# Altium project 2024001 A Soutra Plainsong Metronome.PrjPcb (part 1 of 3)
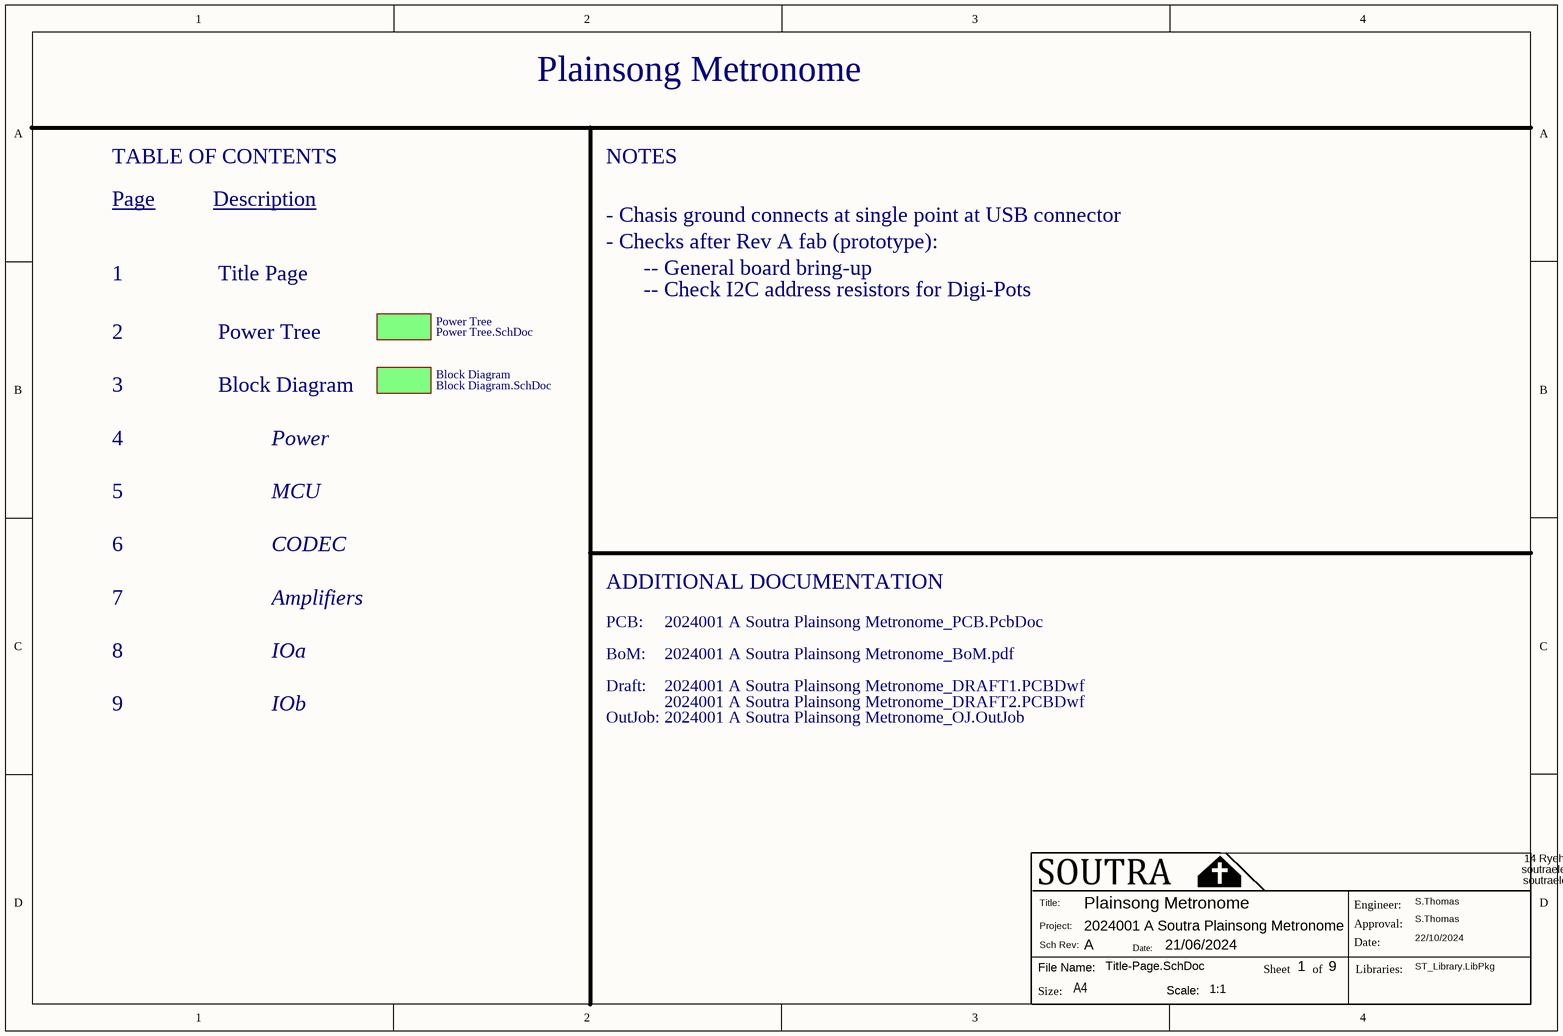
[diagram p0: Title-Page.SchDoc]
Website: soutraelectronics.com; TotalSheets: 9; Title: Plainsong Metronome; SCH_SCALE: 1:1; Sch_Rev: A; Rev_Date: 21/06/2024; Project: 2024001 A Soutra Plainsong Metronome; Pcb_Scale: 1/1; PCB_Rev: A; PCB_Doc: 2024001 A Soutra Plainsong Metronome_PCB.PcbDoc; OutJob_Doc: 2024001 A Soutra Plainsong Metronome_OJ.OutJob; Library: ST_Library.LibPkg; ERC: 2024001 A Soutra Plainsong Metronome_ERC; Engineer: S.Thomas; Draft_Rev: A; Draft_Doc: Draft_Doc.draft; Draft2_Doc: 2024001 A Soutra Plainsong Metronome_DRAFT2.PCBDwf; Draft1_Doc: 2024001 A Soutra Plainsong Metronome_DRAFT1.PCBDwf; Contact: soutraelectronics@gmail.com    +44(0)7874693650; BoM_Rev: A; BoM_Doc: 2024001 A Soutra Plainsong Metronome_BoM.pdf; Approver: S.Thomas; Approval_Date: 22/10/2024; Address: 14 Ryehill Gardens, Edinburgh, EH6 8ER
9 sheets, 157 parts. Net scope: flat (ports and power ports of the same name join across sheets).
Board file: 2024001 A Soutra Plainsong Metronome_PCB.PcbDoc
Sheets:
  Title-Page.SchDoc
    Power Tree = Power Tree.SchDoc
    Block Diagram = Block Diagram.SchDoc
      Designator = Power.SchDoc
      Designator = CODEC.SchDoc
      Designator = MCU.SchDoc
      Designator = Amplifiers.SchDoc
      Designator = IOa.SchDoc
      Designator = IOb.SchDoc

## Sheet Title-Page.SchDoc: Plainsong Metronome
size A4; SheetNumber: 1; SheetTotal: 9

### Sub-sheets
Block Diagram = Block Diagram.SchDoc: no entries
Power Tree = Power Tree.SchDoc: no entries

### Notes on the sheet
- TABLE OF CONTENTS
- NOTES
- Page
- Description
- - Chasis ground connects at single point at USB connector
- 1
- Title Page
- - Checks after Rev A fab (prototype):
- -- General board bring-up
- -- Check I2C address resistors for Digi-Pots
- 2
- Power Tree
- 3
- 4
- Block Diagram
- Power
- 5
- MCU
- 6
- CODEC
- 7
- Amplifiers
- ADDITIONAL DOCUMENTATION
- PCB:
- 8
- 9
- IOa
- IOb
- BoM:
- Draft:
- OutJob:
- Title:
- Engineer:
- File Name:
- Size:
- Project:
- Sch Rev:
- Date:
- Scale:
- Sheet
- of
- Approval:
- Libraries:
- A4

## Sheet Power Tree.SchDoc: Plainsong Metronome
size A4; SheetNumber: 2; SheetTotal: 9
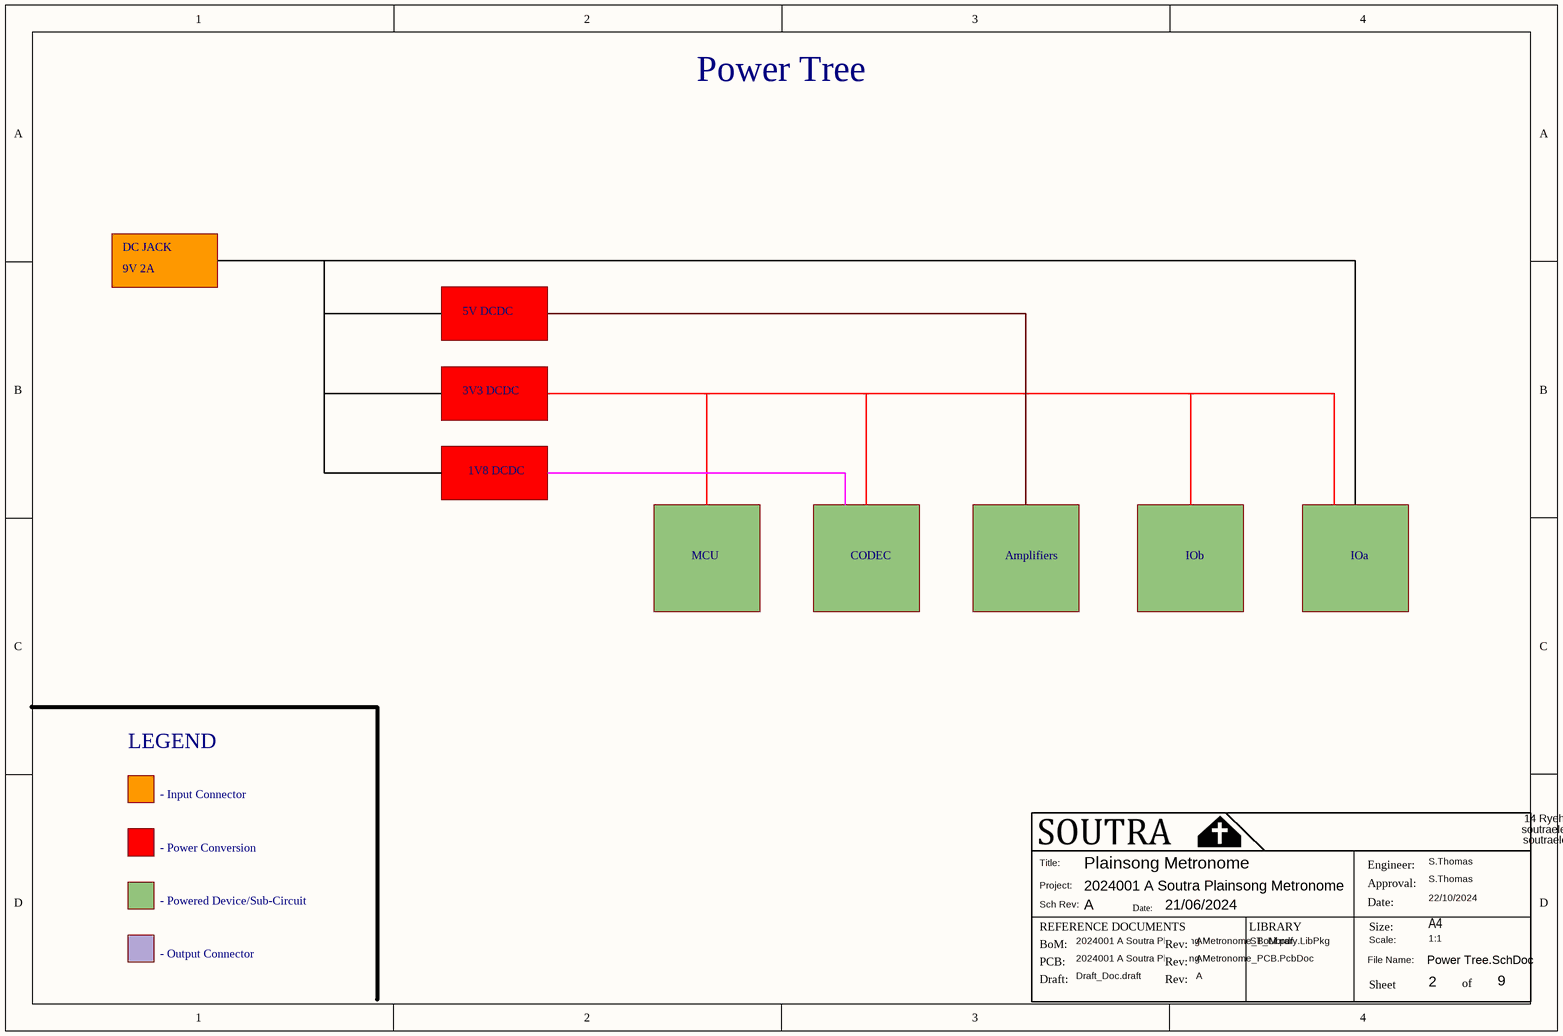
[diagram p1: Power Tree.SchDoc]

### Notes on the sheet
- Power Tree
- DC JACK
- 9V 2A
- 5V DCDC
- 3V3 DCDC
- 1V8 DCDC
- MCU
- CODEC
- Amplifiers
- IOb
- IOa
- LEGEND
- - Input Connector
- - Power Conversion
- - Powered Device/Sub-Circuit
- Title:
- Project:
- Sch Rev:
- Date:
- Engineer:
- Approval:
- - Output Connector
- REFERENCE DOCUMENTS
- BoM:
- PCB:
- Draft:
- Rev:
- LIBRARY
- File Name:
- Scale:
- Size:
- Sheet
- A4
- of

## Sheet Block Diagram.SchDoc: Plainsong Metronome
size A4; SheetNumber: 3; SheetTotal: 9
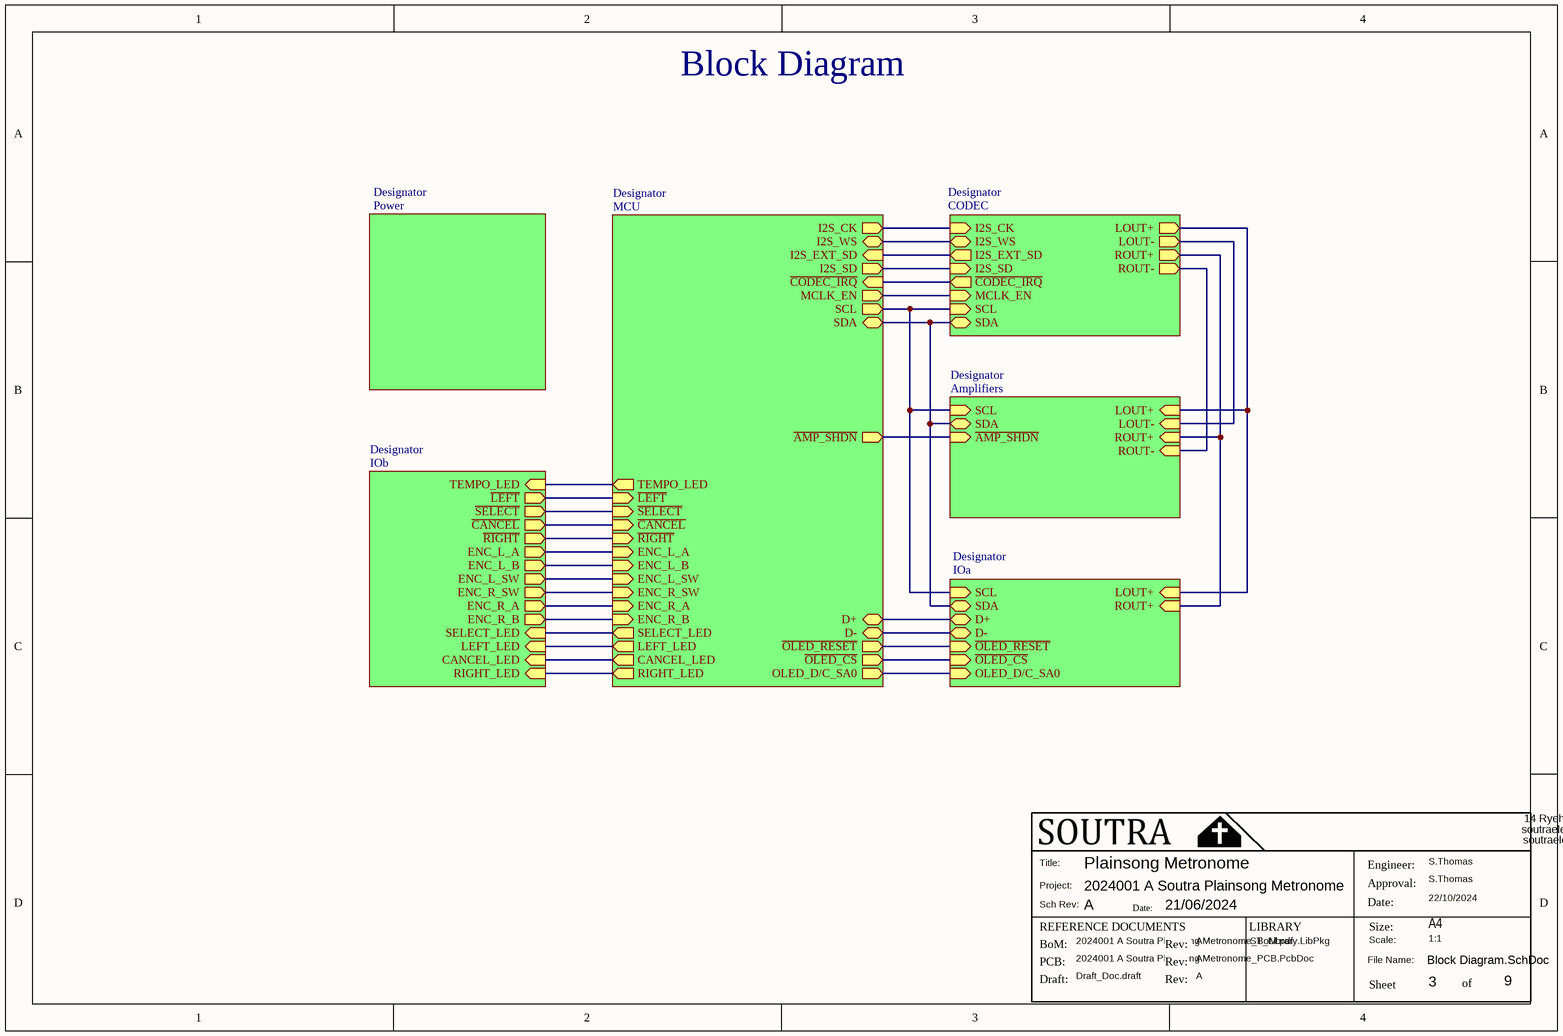
[diagram p2: Block Diagram.SchDoc]

### Sub-sheets
Designator = Power: no entries
Designator = CODEC: SCL (in), SDA (bidir), I2S_SD (in), I2S_EXT_SD (out), I2S_WS (bidir), I2S_CK (in), ~{CODEC_IRQ} (out), LOUT+ (out), LOUT- (out), ROUT+ (out), ROUT- (out), MCLK_EN (in)
Designator = MCU: D- (bidir), D+ (bidir), ENC_L_A (in), ENC_L_SW (in), ENC_L_B (in), RIGHT_LED (out), LEFT_LED (out), ~{LEFT} (in), ~{RIGHT} (in), ~{SELECT} (in), ENC_R_SW (in), ENC_R_A (in), ENC_R_B (in), SCL (out), SDA (bidir), ~{CANCEL} (in), TEMPO_LED (out), SELECT_LED (out), CANCEL_LED (out), I2S_SD (out), I2S_EXT_SD (in), I2S_WS (bidir), I2S_CK (out), ~{CODEC_IRQ} (in), MCLK_EN (out), ~{OLED_CS} (out), ~{OLED_RESET} (out), OLED_D/C_SA0 (out), ~{AMP_SHDN} (out)
Designator = Amplifiers: ROUT+ (in), ROUT- (in), ~{AMP_SHDN} (in), LOUT+ (in), SCL (in), SDA (bidir), LOUT- (in)
Designator = IOa: D- (bidir), D+ (bidir), LOUT+ (in), ROUT+ (in), ~{OLED_CS} (in), ~{OLED_RESET} (in), OLED_D/C_SA0 (in), SDA (bidir), SCL (in)
Designator = IOb: ~{LEFT} (out), ~{SELECT} (out), ~{CANCEL} (out), ~{RIGHT} (out), ENC_L_A (out), ENC_L_B (out), ENC_L_SW (out), ENC_R_SW (out), ENC_R_A (out), ENC_R_B (out), SELECT_LED (in), LEFT_LED (in), CANCEL_LED (in), RIGHT_LED (in), TEMPO_LED (in)

### Nets
(unnamed): sheet Designator/SCL, sheet Designator/SCL, sheet Designator/SCL, sheet Designator/SCL
(unnamed): sheet Designator/SDA, sheet Designator/SDA, sheet Designator/SDA, sheet Designator/SDA
(unnamed): sheet Designator/I2S_SD, sheet Designator/I2S_SD
(unnamed): sheet Designator/I2S_EXT_SD, sheet Designator/I2S_EXT_SD
(unnamed): sheet Designator/I2S_WS, sheet Designator/I2S_WS
(unnamed): sheet Designator/I2S_CK, sheet Designator/I2S_CK
(unnamed): sheet Designator/~{CODEC_IRQ}, sheet Designator/~{CODEC_IRQ}
(unnamed): sheet Designator/LOUT+, sheet Designator/LOUT+, sheet Designator/LOUT+
(unnamed): sheet Designator/LOUT-, sheet Designator/LOUT-
(unnamed): sheet Designator/ROUT+, sheet Designator/ROUT+, sheet Designator/ROUT+
(unnamed): sheet Designator/ROUT-, sheet Designator/ROUT-
(unnamed): sheet Designator/MCLK_EN, sheet Designator/MCLK_EN
(unnamed): sheet Designator/D-, sheet Designator/D-
(unnamed): sheet Designator/D+, sheet Designator/D+
(unnamed): sheet Designator/ENC_L_A, sheet Designator/ENC_L_A
(unnamed): sheet Designator/ENC_L_SW, sheet Designator/ENC_L_SW
(unnamed): sheet Designator/ENC_L_B, sheet Designator/ENC_L_B
(unnamed): sheet Designator/RIGHT_LED, sheet Designator/RIGHT_LED
(unnamed): sheet Designator/LEFT_LED, sheet Designator/LEFT_LED
(unnamed): sheet Designator/~{LEFT}, sheet Designator/~{LEFT}
(unnamed): sheet Designator/~{RIGHT}, sheet Designator/~{RIGHT}
(unnamed): sheet Designator/~{SELECT}, sheet Designator/~{SELECT}
(unnamed): sheet Designator/ENC_R_SW, sheet Designator/ENC_R_SW
(unnamed): sheet Designator/ENC_R_A, sheet Designator/ENC_R_A
(unnamed): sheet Designator/ENC_R_B, sheet Designator/ENC_R_B
(unnamed): sheet Designator/~{CANCEL}, sheet Designator/~{CANCEL}
(unnamed): sheet Designator/TEMPO_LED, sheet Designator/TEMPO_LED
(unnamed): sheet Designator/SELECT_LED, sheet Designator/SELECT_LED
(unnamed): sheet Designator/CANCEL_LED, sheet Designator/CANCEL_LED
(unnamed): sheet Designator/~{OLED_CS}, sheet Designator/~{OLED_CS}
(unnamed): sheet Designator/~{OLED_RESET}, sheet Designator/~{OLED_RESET}
(unnamed): sheet Designator/OLED_D/C_SA0, sheet Designator/OLED_D/C_SA0
(unnamed): sheet Designator/~{AMP_SHDN}, sheet Designator/~{AMP_SHDN}

### Notes on the sheet
- Block Diagram
- Title:
- Project:
- Sch Rev:
- Date:
- Engineer:
- Approval:
- REFERENCE DOCUMENTS
- BoM:
- PCB:
- Draft:
- Rev:
- LIBRARY
- File Name:
- Scale:
- Size:
- Sheet
- A4
- of

## Sheet Power.SchDoc: Plainsong Metronome
size A4; SheetNumber: 4; SheetTotal: 9
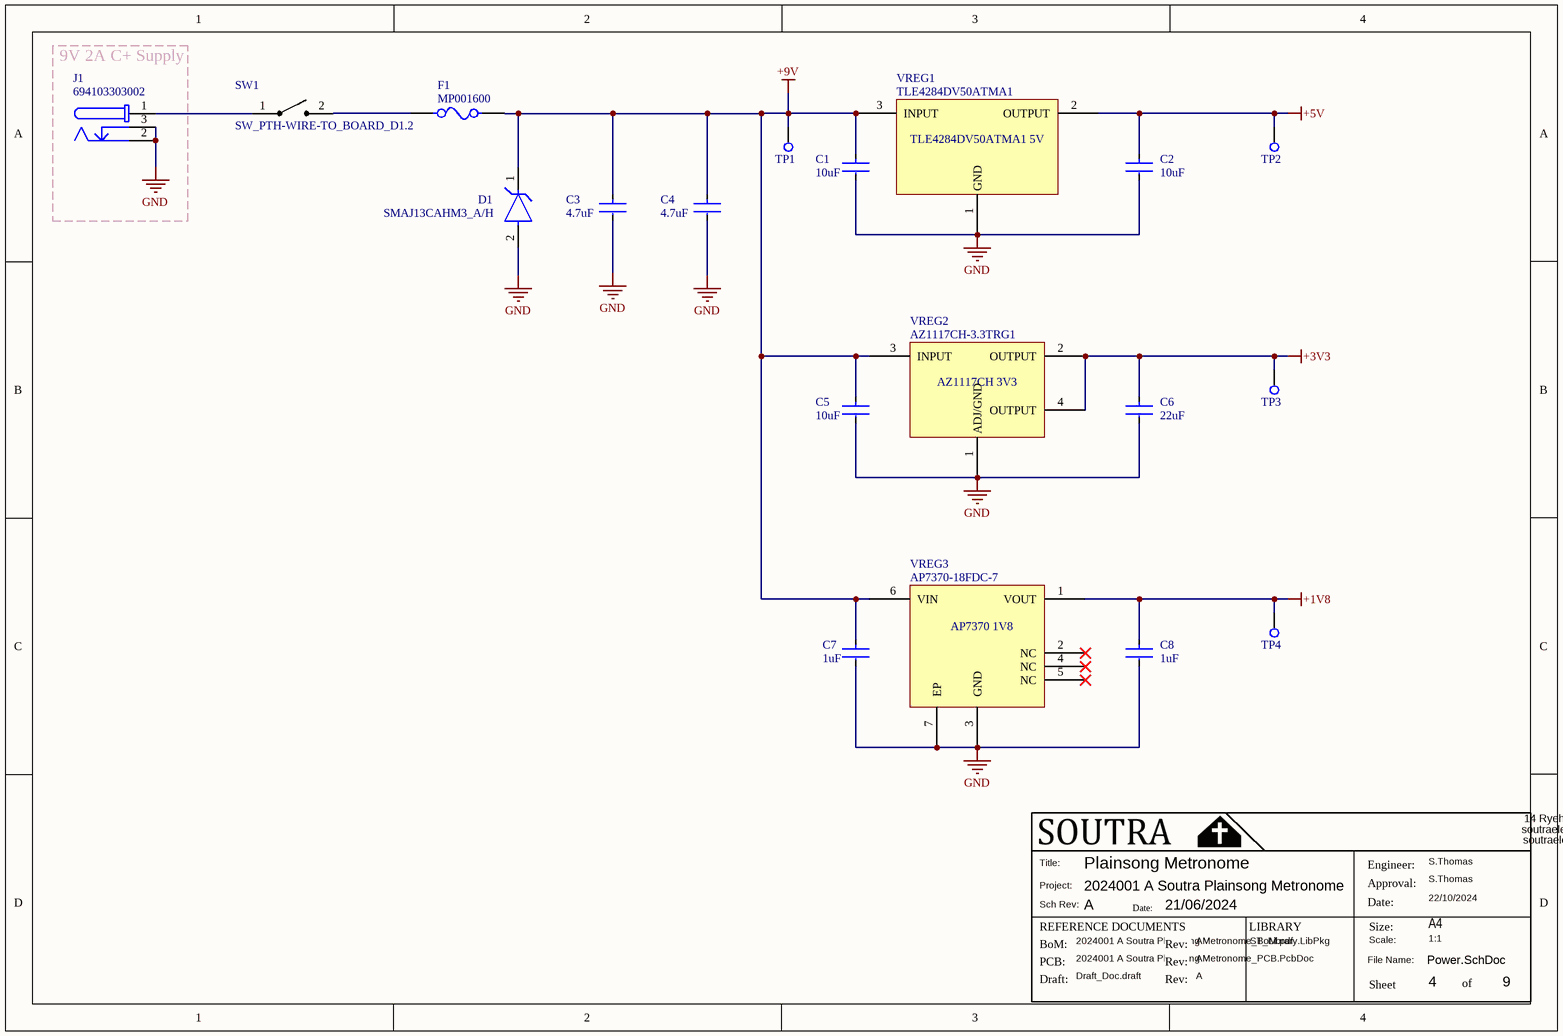
[diagram p3: Power.SchDoc]

### Parts
C1  value 10uF  [CC1206-IPC_A]  (hidden comment: 1206B106K250CP)
C2  value 10uF  [CC1206-IPC_A]  (hidden comment: 1206B106K250CP)
C3  value 4.7uF  [CC1206-IPC_A]  (hidden comment: CL31B475KAHNNNE)
C4  value 4.7uF  [CC1206-IPC_A]  (hidden comment: CL31B475KAHNNNE)
C5  value 10uF  [CC1206-IPC_A]  (hidden comment: 1206B106K250CP)
C6  value 22uF  [CAPC2012X14L]  (hidden comment: GRM21BR61A226ME51L)
C7  value 1uF  [CAPC1005X06L]  (hidden comment: CC0402KRX5R6BB105)
C8  value 1uF  [CAPC1005X06L]  (hidden comment: CC0402KRX5R6BB105)
D1  SMAJ13CAHM3_A/H  [SODFL511X229-2N]
F1  MP001600  [FUSE_3216X08L]
J1  694103303002  [WURTH_694106301002]
SW1  SW_PTH-WIRE-TO_BOARD_D1.2  [SW_PTH-Wire-to-Board-D1.2]
TP1  TP_CIRCLE_R1  [TP_CIRCLE_R1]  (value not drawn)
TP2  TP_CIRCLE_R1  [TP_CIRCLE_R1]  (value not drawn)
TP3  TP_CIRCLE_R1  [TP_CIRCLE_R1]  (value not drawn)
TP4  TP_CIRCLE_R1  [TP_CIRCLE_R1]  (value not drawn)
VREG1  TLE4284DV50ATMA1  [TO252-3-11_L]
VREG2  AZ1117CH-3.3TRG1  [SOT230P700X180-4L]
VREG3  AP7370-18FDC-7  [U-DFN2020EP65P201X201X63_HS-7L]

### Blocks framed on the sheet
9V 2A C+ Supply: J1

### Nets
+1V8: C8.1 TP4.1 VREG3.1(VOUT)
+3V3: C6.1 TP3.1 VREG2.2(OUTPUT) VREG2.4(OUTPUT)
+5V: C2.1 TP2.1 VREG1.2(OUTPUT)
+9V: C1.1 C3.1 C4.1 C5.1 C7.1 D1.1(C) F1.2 TP1.1 VREG1.3(INPUT) VREG2.3(INPUT) VREG3.6(VIN)
GND: C1.2 C2.2 C3.2 C4.2 C5.2 C6.2 C7.2 C8.2 D1.2(A) J1.2 J1.3 VREG1.1(GND) VREG2.1(ADJ/GND) VREG3.3(GND) VREG3.7(EP)
NetF1_1: F1.1 SW1.2
NetJ1_1: J1.1 SW1.1

Not connected (* = marked no-connect by the designer): VREG3 2(NC)* 4(NC)* 5(NC)*

### Notes on the sheet
- Title:
- Project:
- Sch Rev:
- Date:
- Engineer:
- Approval:
- REFERENCE DOCUMENTS
- BoM:
- PCB:
- Draft:
- Rev:
- LIBRARY
- File Name:
- Scale:
- Size:
- Sheet
- A4
- of
- (in symbol AP7370-18FDC-7) AP7370 1V8
- (in symbol AZ1117CH-3.3TRG1) AZ1117CH 3V3
- (in symbol TLE4284DV50ATMA1) TLE4284DV50ATMA1 5V

### Library data of the parts
C1 C2 C5 = 1206B106K250CP: Cap, 10Uf, 25V, Mlcc, 1206 Rohs Compliant: Yes; Manufacturer: Walsin Technologies; Supplier 1: Farnell; Supplier Part Number 1: 3764170; Manufacturer Part Number: 1206B106K250CP; RoHS: No; Stock 1: 1410; Pricing 1: 5=0.114, 50=0.11, 250=0.098, 500=0.096, 1000=0.094 (GBP)
C3 C4 = CL31B475KAHNNNE: Ceramic Capacitor, Multilayer, Ceramic, 25V, 10% +Tol, 10% -Tol, X7R, 15% TC, 4.7uF, Surface Mount, 1206; Manufacturer: Samsung; Multilayer: Yes; Supplier: Digikey; Supplier Part Number: 1276-1055-1-ND; Manufacturer Part Number: CL31B475KAHNNNE; RoHS: Yes; Category: Ceramic Capacitors; Stock: 245034; Pricing: 1=0.18, 10=0.116, 50=0.0732, 100=0.0585, 500=0.04228, 1000=0.0374 (USD); Mounting Technology: Surface Mount; Pins: 2; Dielectric Material: Ceramic; Package Shape: Rectangular; Case/Package: 1206; Terminal Finish: Nickel; Min Operating Temperature: -55°C; Max Operating Temperature: 125°C; JESD-609 Code: e3; Capacitor Type: Ceramic; Tolerance  (fill in as +-): 10%; Package Style: SMTMeter; Packaging: Tape and Reel; Tolerance (fill in as +-): 10%; Rated DC Voltage (URdc): 25V; Temperature Characteristics Code: X7R; Termination: Wraparound; Length: 3.2mm; Width: 1.6mm; Height: 1.8mm; Reach SVHC Compliant: Yes; RoHS Compliant: Yes; ComponentLink1URL: https://datasheet.ciiva.com:443/pdfs/VipMasterIC/IC/SEMS/SEMS-S-A0008522756/SEMS-S-A0008522493-1.pdf?src-supplier=IHS+Markit; ComponentLink1Description: https://datasheet.ciiva.com:443/pdfs/VipMasterIC/IC/SEMS/SEMS-S-A0008522756/SEMS-S-A0008522493-1.pdf?src-supplier=IHS+Markit; ComponentLink2URL: https://datasheet.ciiva.com/25728/cl31b475kahnnne-25728538.pdf?src-supplier=Digikey; ComponentLink2Description: https://datasheet.ciiva.com/25728/cl31b475kahnnne-25728538.pdf?src-supplier=Digikey; ComponentLink3URL: https://datasheet.ciiva.com/29200/452772-da-01-en-vs-kondensator-1206-29200897.pdf?src-supplier=Conrad; ComponentLink3Description: https://datasheet.ciiva.com/29200/452772-da-01-en-vs-kondensator-1206-29200897.pdf?src-supplier=Conrad; ComponentLink4URL: https://datasheet.ciiva.com/29200/452785-da-01-en-vs-kondensator-1206-29200901.pdf?src-supplier=Conrad; ComponentLink4Description: https://datasheet.ciiva.com/29200/452785-da-01-en-vs-kondensator-1206-29200901.pdf?src-supplier=Conrad; ComponentLink5URL: https://datasheet.ciiva.com/26310/mlcc-catalogdownload2013-eng-26310092.pdf?src-supplier=Distrelec; ComponentLink5Description: https://datasheet.ciiva.com/26310/mlcc-catalogdownload2013-eng-26310092.pdf?src-supplier=Distrelec; ComponentLink6URL: https://datasheet.ciiva.com/16428/cl10c1r5bb8nnnc-16428942.pdf?src-supplier=Future+Electronics; ComponentLink6Description: https://datasheet.ciiva.com/16428/cl10c1r5bb8nnnc-16428942.pdf?src-supplier=Future+Electronics; Supplier 1: Farnell; Supplier Part Number 1: 3013532; Pricing 1: 5=0.08, 50=0.05
C6 = GRM21BR61A226ME51L: SMD Multilayer Ceramic Capacitor, 22 µF, 10 V, 0805 [2012 Metric], ± 20%, X5R, GRM Series; Alternative Part: C2012X5R1A226M125AB; Alternative Part Manufacturer: TDK; Manufacturer: Murata; Supplier 1: Farnell; Supplier Part Number 1: 2494270; Pricing 1: 5=0.192, 50=0.09; Stock 1: 79616; Alternative Supplier: Digikey; Alternative Supplier Part Number: 490-10511-1-ND; Pricing 2: 1=0.22, 10=0.14, 50=0.09, 100=0.07; Alternative Part Supplier: Farnell; Alternative Part Supplier Part Number: 2525131; Manufacturer Part Number: GRM21BR61A226ME51L
C7 C8 = CC0402KRX5R6BB105: Ceramic Capacitor, Multilayer, Ceramic, 10V, 10% +Tol, 10% -Tol, X5R, 15% TC, 1uF, Surface Mount, 0402; Manufacturer: Yageo; Alternative Part: 0402ZD105KAT2A; Alternative Part Manufacturer: KYOCERA AVX; Multilayer: Yes; Supplier: Farnell; Supplier Part Number: 1458896; Manufacturer Part Number: CC0402KRX5R6BB105; RoHS: Yes; Category: Ceramic Capacitors; Stock: 12220000; Pricing: 10=0.039, 100=0.023; Mounting Technology: Surface Mount; Pins: 2; Dielectric Material: Ceramic; Package Shape: Rectangular; Case/Package: 0402; Terminal Finish: Nickel; Min Operating Temperature: -55°C; Max Operating Temperature: 85°C; JESD-609 Code: e3; Capacitor Type: Ceramic; Tolerance  (fill in as +-): 10%; Package Style: SMTMeter; Packaging: Tape and Reel; Tolerance (fill in as +-): 10%; Rated DC Voltage (URdc): 10V; Temperature Characteristics Code: X5R; Termination: Wraparound; Length: 1mm; Width: 0.5mm; Height: 0.5mm; Reach SVHC Compliant: Yes; RoHS Compliant: Yes; ComponentLink1URL: https://datasheet.ciiva.com:443/pdfs/VipMasterIC/IC/YAGO/YAGO-S-A0006851646/YAGO-S-A0006851646-1.pdf?src-supplier=IHS+Markit; ComponentLink1Description: https://datasheet.ciiva.com:443/pdfs/VipMasterIC/IC/YAGO/YAGO-S-A0006851646/YAGO-S-A0006851646-1.pdf?src-supplier=IHS+Markit; ComponentLink2URL: https://datasheet.ciiva.com/176/upy-gphc-x5r-4v-to-50v-12-176704.pdf?src-supplier=Digi-Key; ComponentLink2Description: https://datasheet.ciiva.com/176/upy-gphc-x5r-4v-to-50v-12-176704.pdf?src-supplier=Digi-Key; ComponentLink3URL: https://datasheet.ciiva.com/176/mlccorderingcode-176705.pdf?src-supplier=Digi-Key; ComponentLink3Description: https://datasheet.ciiva.com/176/mlccorderingcode-176705.pdf?src-supplier=Digi-Key; ComponentLink4URL: https://datasheet.ciiva.com/176/mlccorderingcode-176706.pdf?src-supplier=Digi-Key; ComponentLink4Description: https://datasheet.ciiva.com/176/mlccorderingcode-176706.pdf?src-supplier=Digi-Key; Supplier 1: Digikey; Supplier Part Number 1: 311-1439-1-ND; Pricing 1: 1=0.08, 10=0.058, 50=0.034, 100=0.027; Alternative Part Supplier: Farnell; Alternative Part Supplier Part Number: 1740588
D1 = SMAJ13CAHM3_A/H: TVS Diode, TRANSZORB SMAJ, Bidirectional, 13 V, 21.5 V, DO-214AC (SMA), 2 Pins; Manufacturer: Vishay; Supplier 1: Farnell; Supplier Part Number 1: 3530003; Pricing 1: 5=0.168, 10=0.146, 100+0.122; Stock 1: 8321; Manufacturer Part Number: SMAJ13CAHM3_A/H
F1 = MP001600: MULTICOMP PRO MP001600Fuse, Surface Mount, 1.5 A, Fast Acting, 72 VDC, 1206 [3216 Metric]; Supplier: Farnell; Supplier Part Number: 3285103; Manufacturer: Multicomp; Manufacturer Part Number: MP001600; RoHS: No; Stock: 2998; Pricing: 5=0.094, 50=0.0739, 250=0.0627, 500=0.0559, 1500=0.0459 (GBP)
J1 = 694103303002: Circular DC Power Connector; Manufacturer: Wurth Electronics; Connector Type: Circular,Power; Supplier: Farnell; Supplier Part Number: 2472149; Manufacturer Part Number: 694103303002; RoHS: Yes; Category: Connectors; Stock: 6324; Pricing: 1=1.14, 10=0.84, 100=0.78; Contact Finish - Mating: NOT SPECIFIED; Reach SVHC Compliant: Yes; RoHS Compliant: Yes; ComponentLink1URL: https://datasheet.ciiva.com:443/pdfs/VipMasterIC/IC/MIDC/MIDC-S-A0001193031/MIDC-S-A0001193031-1.pdf?src-supplier=IHS+Markit; ComponentLink1Description: https://datasheet.ciiva.com:443/pdfs/VipMasterIC/IC/MIDC/MIDC-S-A0001193031/MIDC-S-A0001193031-1.pdf?src-supplier=IHS+Markit; ComponentLink2URL: http://www.mouser.com/ds/2/445/6941xx303002-469289.pdf?src-supplier=Mouser; ComponentLink2Description: http://www.mouser.com/ds/2/445/6941xx303002-469289.pdf?src-supplier=Mouser; ComponentLink3URL: http://www.farnell.com/cad/2130963.pdf?src-supplier=Element14; ComponentLink3Description: http://www.farnell.com/cad/2130963.pdf?src-supplier=Element14; ComponentLink4URL: https://katalog.we-online.de/em/datasheet/6941xx303002.pdf?src-supplier=Digikey; ComponentLink4Description: https://katalog.we-online.de/em/datasheet/6941xx303002.pdf?src-supplier=Digikey; Supplier 1: Digikey; Supplier Part Number 1: 732-5930-ND; Stock 1: 11140; Pricing 1: 1=0.81, 10=0.77, 50=0.68, 100=0.63
SW1 = SW_PTH-WIRE-TO_BOARD_D1.2: PTH Mounting Holes for Wire-to-board switch, 1.2mm diameter, >=17AWG
TP1-TP4 = TP_CIRCLE_R1: Test Point, SMD, Circular, Radius = 1mm
VREG1 = TLE4284DV50ATMA1: Manufacturer: Infineon; Supplier 1: Farnell; Supplier Part Number 1: TLE4284DV50ATMA1; Pricing 1: 5=1.49, 50=1.38, 100=1.27; Stock 1: 24605; Manufacturer Part Number: TLE4284DV50ATMA1
VREG2 = AZ1117CH-3.3TRG1: Fixed Positive LDO Regulator, 3.3V, 1.3V Dropout, BIPolar, PDSO3; Manufacturer: Diodes; Package Body Material: Plastic; Dropout Voltage1-Nom: 1.2V; Input Voltage Absolute-Max: 18V; Max Supply Voltage: 15V; Line Regulation-Max: 0.01%; Load Regulation-Max: 0.015%; Channels: 1; Output Current1-Max: 800mA; Output Voltage1-Max: 3.365V; Output Voltage1-Min: 3.235V; Regulator Type: FIXED POSITIVE SINGLE OUTPUT LDO REGULATOR; Voltage Tolerance-Max: 1.97%; Qualification Status: Not Qualified; Supplier: Farnell; Supplier Part Number: 3483073; Manufacturer Part Number: AZ1117CH-3.3TRG1; RoHS: Yes; Category: Voltage Regulators - Linear; Stock: 8830; Pricing: 5=0.42, 10=0.25, 100=0.12; Case/Package: SOP; Pins: 3; Package Shape: Rectangular; Terminal Finish: Tin; JESD-609 Code: e3; Adjustability: FIXED; Dropout Voltage1-Max: 1.3V; JESD-30 Code: R-PDSO-G3; Moisture Sensitivity Level: 1; Number of Outputs: 1; Operating Temperature, TJ-Max: 125°C; Operating Temperature, TJ-Min: -20°C; Output Voltage1-Nom: 3.3V; Package Style: SMALL OUTLINEMeter; Packaging: Tape and Reel; Surface Mount: Yes; Technology: BIPOLAR; Terminal Form: Gull Wing; Terminal Position: DUAL; Length: 6.5mm; Width: 3.5mm; Terminal Pitch: 2.3mm; Height - Seated (Max): 1.8mm; Reach SVHC Compliant: Yes; RoHS Compliant: Yes; ComponentLink1URL: https://datasheet.ciiva.com:443/pdfs/VipMasterIC/IC/DIOD/DIOD-S-A0007713706/DIOD-S-A0007713706-1.pdf?src-supplier=IHS+Markit; ComponentLink1Description: https://datasheet.ciiva.com:443/pdfs/VipMasterIC/IC/DIOD/DIOD-S-A0007713706/DIOD-S-A0007713706-1.pdf?src-supplier=IHS+Markit; ComponentLink2URL: https://datasheet.ciiva.com/29569/az1117c-29569913.pdf?src-supplier=Digikey; ComponentLink2Description: https://datasheet.ciiva.com/29569/az1117c-29569913.pdf?src-supplier=Digikey; ComponentLink3URL: https://datasheet.ciiva.com/29569/az1117c-29569914.pdf?src-supplier=Digikey; ComponentLink3Description: https://datasheet.ciiva.com/29569/az1117c-29569914.pdf?src-supplier=Digikey; ComponentLink4URL: https://datasheet.ciiva.com/29569/az1117c-29569915.pdf?src-supplier=Digikey; ComponentLink4Description: https://datasheet.ciiva.com/29569/az1117c-29569915.pdf?src-supplier=Digikey; Supplier 1: Digikey; Supplier Part Number 1: AZ1117CH-3.3TRG1DICT-ND; Pricing 1: 1=0.36, 10=0.27, 25=0.23, 100=0.15
VREG3 = AP7370-18FDC-7: Fixed Positive LDO Regulator; Manufacturer: Diodes; Supplier: Farnell; Supplier Part Number: 3864505; Manufacturer Part Number: AP7370-18FDC-7; RoHS: Yes; Stock: 2900; Pricing: 5=0.53, 10=0.42, 100=0.23; Supplier 1: Mouser; Supplier Part Number 1: 621-AP7370-18FDC-7; Pricing 1: 1=0.38, 10=0.271, 100=0.19

## Sheet CODEC.SchDoc: Plainsong Metronome
size A4; SheetNumber: 6; SheetTotal: 9
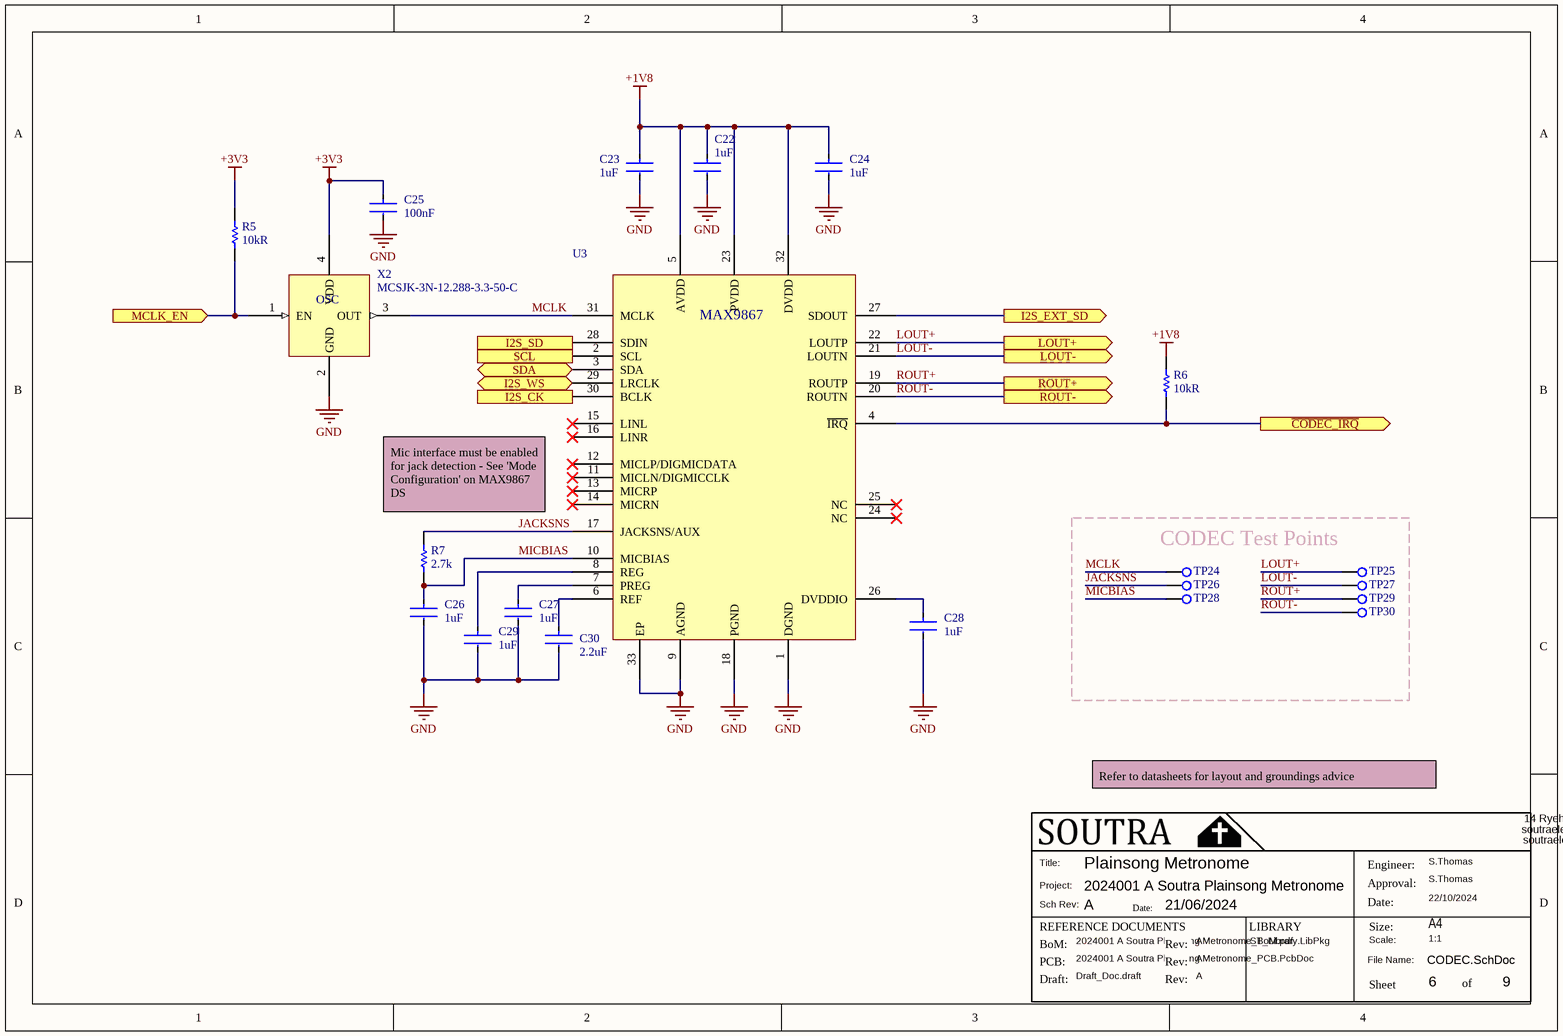
[diagram p4: CODEC.SchDoc]

### Parts
C22  value 1uF  [CAPC1005X06L]  (hidden comment: CC0402KRX5R6BB105)
C23  value 1uF  [CAPC1005X06L]  (hidden comment: CC0402KRX5R6BB105)
C24  value 1uF  [CAPC1005X06L]  (hidden comment: CC0402KRX5R6BB105)
C25  value 100nF  [CAPC1005X06L]  (hidden comment: 0402X104M160CT)
C26  value 1uF  [CAPC1005X06L]  (hidden comment: CC0402KRX5R6BB105)
C27  value 1uF  [CAPC1005X06L]  (hidden comment: CC0402KRX5R6BB105)
C28  value 1uF  [CAPC1005X06L]  (hidden comment: CC0402KRX5R6BB105)
C29  value 1uF  [CAPC1005X06L]  (hidden comment: CC0402KRX5R6BB105)
C30  value 2.2uF  [CAPC1005X06L]  (hidden comment: CC0402MRX5R5BB225)
R5  value 10kR  [RESC_0805_2013X50X30LL20T20]  (hidden comment: RC0805JR-0710KL)
R6  value 10kR  [RESC_0805_2013X50X30LL20T20]  (hidden comment: RC0805JR-0710KL)
R7  value 2.7k  [RESC_0805_2013X50X30LL20T20]  (hidden comment: CRGH0805F2K7)
TP24  TP_CIRCLE_R1  [TP_CIRCLE_R1]  (value not drawn)
TP25  TP_CIRCLE_R1  [TP_CIRCLE_R1]  (value not drawn)
TP26  TP_CIRCLE_R1  [TP_CIRCLE_R1]  (value not drawn)
TP27  TP_CIRCLE_R1  [TP_CIRCLE_R1]  (value not drawn)
TP28  TP_CIRCLE_R1  [TP_CIRCLE_R1]  (value not drawn)
TP29  TP_CIRCLE_R1  [TP_CIRCLE_R1]  (value not drawn)
TP30  TP_CIRCLE_R1  [TP_CIRCLE_R1]  (value not drawn)
U3  (no value)  [TQFN50P500X500X80_HS-33L]
X2  MCSJK-3N-12.288-3.3-50-C  [X_MULTICOMP_MCSJK-3N-12.288-3.3-50-C]

### Blocks framed on the sheet
CODEC Test Points: TP24-TP30

### Ports
I2S_CK (in, see Block Diagram[3A], MCU[3B]), I2S_EXT_SD (out, see Block Diagram[3A], MCU[3B]), I2S_SD (in, see Block Diagram[3B], MCU[3B]), I2S_WS (bidir, see Block Diagram[3A], MCU[3B]), LOUT+ (out, see Block Diagram[4A], Amplifiers[1B], IOa[3A]), LOUT- (out, see Block Diagram[4A], Amplifiers[1B]), MCLK_EN (in, see Block Diagram[3B], MCU[3B]), ROUT+ (out, see Block Diagram[4A], Amplifiers[3B], IOa[3A]), ROUT- (out, see Block Diagram[4B], Amplifiers[3B]), SCL (in, see Block Diagram[3B], Amplifiers[1A], IOa[1C], MCU[4B]), SDA (bidir, see Block Diagram[3B], Amplifiers[1A], IOa[1C], MCU[4B]), ~{CODEC_IRQ} (out, see Block Diagram[3B], MCU[3B])

### Nets
+1V8: C22.1 C23.1 C24.1 R6.2 U3.5(AVDD) U3.23(PVDD) U3.32(DVDD)
+3V3: C25.1 R5.2 X2.4(VDD)
GND: C22.2 C23.2 C24.2 C25.2 C26.2 C27.2 C28.2 C29.2 C30.2 U3.1(DGND) U3.9(AGND) U3.18(PGND) U3.33(EP) X2.2(GND)
~{CODEC_IRQ}: R6.1 U3.4(~{IRQ}) ; port ~{CODEC_IRQ}
I2S_CK: U3.30(BCLK) ; port I2S_CK
I2S_EXT_SD: U3.27(SDOUT) ; port I2S_EXT_SD
I2S_SD: U3.28(SDIN) ; port I2S_SD
I2S_WS: U3.29(LRCLK) ; port I2S_WS
JACKSNS: R7.1 TP26.1 U3.17(JACKSNS/AUX)
LOUT+: TP25.1 U3.22(LOUTP) ; port LOUT+
LOUT-: TP27.1 U3.21(LOUTN) ; port LOUT-
MCLK: TP24.1 U3.31(MCLK) X2.3(OUT)
MCLK_EN: R5.1 X2.1(EN) ; port MCLK_EN
MICBIAS: C26.1 R7.2 TP28.1 U3.10(MICBIAS)
ROUT+: TP29.1 U3.19(ROUTP) ; port ROUT+
ROUT-: TP30.1 U3.20(ROUTN) ; port ROUT-
SCL: U3.2(SCL) ; port SCL
SDA: U3.3(SDA) ; port SDA
NetC27_1: C27.1 U3.7(PREG)
NetC28_1: C28.1 U3.26(DVDDIO)
NetC29_1: C29.1 U3.8(REG)
NetC30_1: C30.1 U3.6(REF)

Not connected (* = marked no-connect by the designer): U3 11(MICLN/DIGMICCLK)* 12(MICLP/DIGMICDATA)* 13(MICRP)* 14(MICRN)* 15(LINL)* 16(LINR)* 24(NC)* 25(NC)*

### Notes on the sheet
- (near R7) Mic interface must be enabled for jack detection - See 'Mode Configuration' on MAX9867 DS
- Refer to datasheets for layout and groundings advice
- Title:
- Project:
- Sch Rev:
- Date:
- Engineer:
- Approval:
- REFERENCE DOCUMENTS
- BoM:
- PCB:
- Draft:
- Rev:
- LIBRARY
- File Name:
- Scale:
- Size:
- Sheet
- A4
- of
- (in symbol MAX9867ETJ+T) MAX9867
- (in symbol MCSJK-3N-12.288-3.3-50-C) OSC

### Library data of the parts
C22-C24 C26-C29 = CC0402KRX5R6BB105: as C7 on sheet Power; Supplier: Farnell; Supplier Part Number: 1458896; Manufacturer Part Number: CC0402KRX5R6BB105; RoHS: Yes; Category: Ceramic Capacitors; Stock: 12220000; Pricing: 10=0.039, 100=0.023; Mounting Technology: Surface Mount; Pins: 2; Dielectric Material: Ceramic; Package Shape: Rectangular; Case/Package: 0402; Terminal Finish: Nickel; Min Operating Temperature: -55°C; Max Operating Temperature: 85°C; JESD-609 Code: e3; Capacitor Type: Ceramic; Tolerance  (fill in as +-): 10%; Package Style: SMTMeter; Packaging: Tape and Reel; Tolerance (fill in as +-): 10%; Rated DC Voltage (URdc): 10V; Temperature Characteristics Code: X5R; Termination: Wraparound; Length: 1mm; Width: 0.5mm; Height: 0.5mm; Reach SVHC Compliant: Yes; RoHS Compliant: Yes; ComponentLink1URL: https://datasheet.ciiva.com:443/pdfs/VipMasterIC/IC/YAGO/YAGO-S-A0006851646/YAGO-S-A0006851646-1.pdf?src-supplier=IHS+Markit; ComponentLink1Description: https://datasheet.ciiva.com:443/pdfs/VipMasterIC/IC/YAGO/YAGO-S-A0006851646/YAGO-S-A0006851646-1.pdf?src-supplier=IHS+Markit; ComponentLink2URL: https://datasheet.ciiva.com/176/upy-gphc-x5r-4v-to-50v-12-176704.pdf?src-supplier=Digi-Key; ComponentLink2Description: https://datasheet.ciiva.com/176/upy-gphc-x5r-4v-to-50v-12-176704.pdf?src-supplier=Digi-Key; ComponentLink3URL: https://datasheet.ciiva.com/176/mlccorderingcode-176705.pdf?src-supplier=Digi-Key; ComponentLink3Description: https://datasheet.ciiva.com/176/mlccorderingcode-176705.pdf?src-supplier=Digi-Key; ComponentLink4URL: https://datasheet.ciiva.com/176/mlccorderingcode-176706.pdf?src-supplier=Digi-Key; ComponentLink4Description: https://datasheet.ciiva.com/176/mlccorderingcode-176706.pdf?src-supplier=Digi-Key; Supplier 1: Digikey; Supplier Part Number 1: 311-1439-1-ND; Pricing 1: 1=0.08, 10=0.058, 50=0.034, 100=0.027; Alternative Part Supplier: Farnell; Alternative Part Supplier Part Number: 1740588
C25 = 0402X104M160CT: Ceramic Capacitor, Multilayer, Ceramic, 16V, 20% +Tol, 20% -Tol, X5R, 15% TC, 0.1uF, Surface Mount, 0402; Manufacturer: Walsin Technologies; Alternative Part: 885012105016; Alternative Part Manufacturer: WURTH; Multilayer: Yes; Supplier: Farnell; Supplier Part Number: 2524808; Manufacturer Part Number: 0402X104M160CT; RoHS: Yes; Category: Ceramic Capacitors; Stock: 1101; Pricing: 10=0.0047, 100=0.0043; Mounting Technology: Surface Mount; Pins: 2; Dielectric Material: Ceramic; Package Shape: Rectangular; Case/Package: 0402; Terminal Finish: Nickel; Min Operating Temperature: -55°C; Max Operating Temperature: 85°C; JESD-609 Code: e3; Capacitor Type: Ceramic; Tolerance  (fill in as +-): 20%; Package Style: SMTMeter; Packaging: Tape and Reel; Tolerance (fill in as +-): 20%; Rated DC Voltage (URdc): 16V; Temperature Characteristics Code: X5R; Termination: Wraparound; Length: 1mm; Width: 0.5mm; Height: 0.5mm; Reach SVHC Compliant: Yes; RoHS Compliant: Yes; ComponentLink1URL: https://datasheet.ciiva.com:443/pdfs/VipMasterIC/IC/WATC/WATC-S-A0009550342/WATC-S-A0009550342-1.pdf?src-supplier=IHS+Markit; ComponentLink1Description: https://datasheet.ciiva.com:443/pdfs/VipMasterIC/IC/WATC/WATC-S-A0009550342/WATC-S-A0009550342-1.pdf?src-supplier=IHS+Markit; ComponentLink2URL: http://www.farnell.com/datasheets/2009679.pdf?src-supplier=Farnell; ComponentLink2Description: http://www.farnell.com/datasheets/2009679.pdf?src-supplier=Farnell; ComponentLink3URL: http://www.farnell.com/datasheets/2340522.pdf?src-supplier=Farnell; ComponentLink3Description: http://www.farnell.com/datasheets/2340522.pdf?src-supplier=Farnell; ComponentLink4URL: https://datasheet.octopart.com/0402X104M160CT-Walsin-Technologies-datasheet-85392065.pdf?src-supplier=Element14; ComponentLink4Description: https://datasheet.octopart.com/0402X104M160CT-Walsin-Technologies-datasheet-85392065.pdf?src-supplier=Element14; ComponentLink5URL: https://datasheet.octopart.com/0402X104M160CT-Walsin-Technologies-datasheet-136037192.pdf?src-supplier=TECHDesign; ComponentLink5Description: https://datasheet.octopart.com/0402X104M160CT-Walsin-Technologies-datasheet-136037192.pdf?src-supplier=TECHDesign; Supplier Part Number 1: 1292-0402X104M160CT-ND; Supplier 1: Digikey; Pricing 1: 1=0.08, 10=0.023, 50=0.013, 100=0.01; Alternative Part Supplier: Farnell; Alternative Part Supplier Part Number: 2533933
C30 = CC0402MRX5R5BB225: Ceramic Capacitor, Multilayer, Ceramic, 6.3V, 20% +Tol, 20% -Tol, X5R, 15% TC, 2.2uF, Surface Mount, 0402; Manufacturer: Yageo; Alternative Part: MC0402X225M6R3CT; Multilayer: Yes; Suppler 2: Digikey; Supplier 1: Farnell; Supplier Part Number 1: 3369189; Manufacturer Part Number: CC0402MRX5R5BB225; RoHS: Yes; Category: Ceramic Capacitors; Stock 1: 22402; Pricing 1: 10=0.0794, 100=0.0451; Mounting Technology: Surface Mount; Pins: 2; Dielectric Material: Ceramic; Package Shape: Rectangular; Case/Package: 0402; Terminal Finish: Nickel; Min Operating Temperature: -55°C; Max Operating Temperature: 85°C; JESD-609 Code: e3; Capacitor Type: Ceramic; Tolerance  (fill in as +-): 20%; Package Style: SMTMeter; Packaging: Tape and Reel; Tolerance (fill in as +-): 20%; Rated DC Voltage (URdc): 6.3V; Temperature Characteristics Code: X5R; Termination: Wraparound; Length: 1mm; Width: 0.5mm; Height: 0.5mm; Reach SVHC Compliant: Yes; RoHS Compliant: Yes; ComponentLink1URL: https://datasheet.ciiva.com:443/pdfs/VipMasterIC/IC/YAGO/YAGO-S-A0006851646/YAGO-S-A0006851646-1.pdf?src-supplier=IHS+Markit; ComponentLink1Description: https://datasheet.ciiva.com:443/pdfs/VipMasterIC/IC/YAGO/YAGO-S-A0006851646/YAGO-S-A0006851646-1.pdf?src-supplier=IHS+Markit; ComponentLink2URL: https://datasheet.ciiva.com/180/mlccorderingcode-180426.pdf?src-supplier=Digikey; ComponentLink2Description: https://datasheet.ciiva.com/180/mlccorderingcode-180426.pdf?src-supplier=Digikey; ComponentLink3URL: https://datasheet.ciiva.com/180/mlccorderingcode-180428.pdf?src-supplier=Digikey; ComponentLink3Description: https://datasheet.ciiva.com/180/mlccorderingcode-180428.pdf?src-supplier=Digikey; ComponentLink4URL: https://datasheet.ciiva.com/180/mlccorderingcode-180427.pdf?src-supplier=Digikey; ComponentLink4Description: https://datasheet.ciiva.com/180/mlccorderingcode-180427.pdf?src-supplier=Digikey; Supplier Part Number 2: 311-1442-1-ND; Stock 2: 156931; Pricing 2: 1=0.09, 10=0.06, 50=0.038, 100=0.030; Alternative Part Supplier: Farnell; Alternative Part Supplier Part Number: 1759376
R5 R6 = RC0805JR-0710KL: Fixed Resistor, Metal Glaze/thick Film, 0.125W, 10000ohm, 150V, 5% +/-Tol, 100ppm/Cel, Surface Mount, 0805; Manufacturer: Yageo; Alternative Part: MCMR08X103 JTL; Additional Feature: LASER TRIMMABLE; Power: 125mW; Rated Temperature: 70°C; Temperature Coefficient: 100ppm/°C; Package Height: 0.5mm; Package Length: 2mm; Package Width: 1.25mm; Supplier: Farnell; Supplier Part Number: 9234136; Manufacturer Part Number: RC0805JR-0710KL; RoHS: Yes; Category: Chip SMD Resistors; Stock: 893694; Pricing: 10=0.013, 100=0.007, 500=0.006; Mounting Technology: Surface Mount; Pins: 2; Package Shape: Rectangular; Case/Package: 0805; Terminal Finish: Nickel; Min Operating Temperature: -55°C; Max Operating Temperature: 155°C; Tolerance: 5%; JESD-609 Code: e3; Resistor Type: FIXED RESISTOR; Construction: Chip; Package Style: SMTMeter; Packaging: Tape and Reel; Technology: METAL GLAZE/THICK FILM; Termination: Wraparound; Working Voltage: 150V; Reach SVHC Compliant: Yes; RoHS Compliant: Yes; ComponentLink1URL: https://datasheet.ciiva.com:443/pdfs/VipMasterIC/IC/YAGO/YAGO-S-A0008145938/YAGO-S-A0008145938-1.pdf?src-supplier=IHS+Markit; ComponentLink1Description: https://datasheet.ciiva.com:443/pdfs/VipMasterIC/IC/YAGO/YAGO-S-A0008145938/YAGO-S-A0008145938-1.pdf?src-supplier=IHS+Markit; ComponentLink2URL: https://datasheet.ciiva.com/7983/444164-7983765.pdf?src-supplier=Element14; ComponentLink2Description: https://datasheet.ciiva.com/7983/444164-7983765.pdf?src-supplier=Element14; ComponentLink3URL: https://datasheet.ciiva.com/7941/444164-7941870.pdf?src-supplier=Element14; ComponentLink3Description: https://datasheet.ciiva.com/7941/444164-7941870.pdf?src-supplier=Element14; ComponentLink4URL: https://datasheet.ciiva.com/7941/444164-7941871.pdf?src-supplier=Element14; ComponentLink4Description: https://datasheet.ciiva.com/7941/444164-7941871.pdf?src-supplier=Element14; Supplier 1: Digikey; Supplier Part Number 1: 311-10KARCT-ND; Pricing 1: 1=0.08, 10=0.018, 50=0.011, 100=0.009; Alternative Part Supplier: Farnell; Alternative Part Supplier Part Number: 2073612
R7 = CRGH0805F2K7: Fixed Resistor, Metal Glaze/thick Film, 0.33W, 2700ohm, 150V, 1% +/-Tol, 100ppm/Cel, Surface Mount, 0805; Manufacturer: TE Connectivity; Alternative Part: MC01W08051100R; Alternative Part Manufacturer: Multicomp Pro; Supplier: Farnell; Supplier Part Number: 2332077; Manufacturer Part Number: CRGH0805F2K7; RoHS: Yes; Category: Chip SMD Resistors; Stock: 2438; Pricing: 10=0.0381; Pins: 2; Resistor Type: FIXED RESISTOR; Reach SVHC Compliant: Yes; RoHS Compliant: Yes; ComponentLink1URL: https://www.te.com:443/usa-en/product-1-2176185-0.datasheet.pdf?src-supplier=IHS+Markit; ComponentLink1Description: https://www.te.com:443/usa-en/product-1-2176185-0.datasheet.pdf?src-supplier=IHS+Markit; ComponentLink2URL: https://datasheet.ciiva.com/22670/1755795-22670377.pdf?src-supplier=Element14; ComponentLink2Description: https://datasheet.ciiva.com/22670/1755795-22670377.pdf?src-supplier=Element14; ComponentLink3URL: https://datasheet.ciiva.com/28583/1755795-28583016.pdf?src-supplier=Element14; ComponentLink3Description: https://datasheet.ciiva.com/28583/1755795-28583016.pdf?src-supplier=Element14; Supplier 1: Mouser; Supplier Part Number 1: 279-CRGH0805F2K7; Pricing 1: 1=0.096, 10=0.065, 100=0.033; Alternative Part Supplier: Farnell; Alternative Part Supplier Part Number: 9332375
TP24-TP30 = TP_CIRCLE_R1: Test Point, SMD, Circular, Radius = 1mm
U3 = MAX9867ETJ+T: PCM Codec; Manufacturer: Maxim; Supplier: Farnell; Supplier Part Number: 2517273; Manufacturer Part Number: MAX9867ETJ+T; RoHS: Yes; Category: CODECs; Stock: 1095; Pricing: 1=2.92, 10=2.45, 25=2.3, 100=2.15; Telecom IC Type: PCM CODEC; Moisture Sensitivity Level: 1; Reach SVHC Compliant: Yes; RoHS Compliant: Yes; ComponentLink1URL: https://datasheet.ciiva.com:443/pdfs/VipMasterIC/IC/MAXM/MAXMS11328/MAXMS11328-1.pdf?src-supplier=IHS+Markit; ComponentLink1Description: https://datasheet.ciiva.com:443/pdfs/VipMasterIC/IC/MAXM/MAXMS11328/MAXMS11328-1.pdf?src-supplier=IHS+Markit; ComponentLink2URL: https://datasheet.ciiva.com/1694/max9867-1694642.pdf?src-supplier=Digikey; ComponentLink2Description: https://datasheet.ciiva.com/1694/max9867-1694642.pdf?src-supplier=Digikey; Supplier 1: Digikey; Supplier Part Number 1: MAX9867ETJ+TCT-ND; Pricing 1: 1=2.95, 10=2.65, 25=2.5, 100=2.17
X2 = MCSJK-3N-12.288-3.3-50-C: CMOS Output Clock Oscillator; Manufacturer: Multicomp; Supplier 1: Farnell; Supplier Part Number 1: 2854277; Manufacturer Part Number: MCSJK-3N-12.288-3.3-50-C; RoHS: No; Stock 1: 2585; Pricing 1: 5=0.644, 50=0.522, 250=0.455, 500=0.442, 1500=0.436, 3000=0.43, 15000=0.421, 30000=0.413 (GBP)